# EAGLE design tiny-tinyisp (EAGLE 6.4)
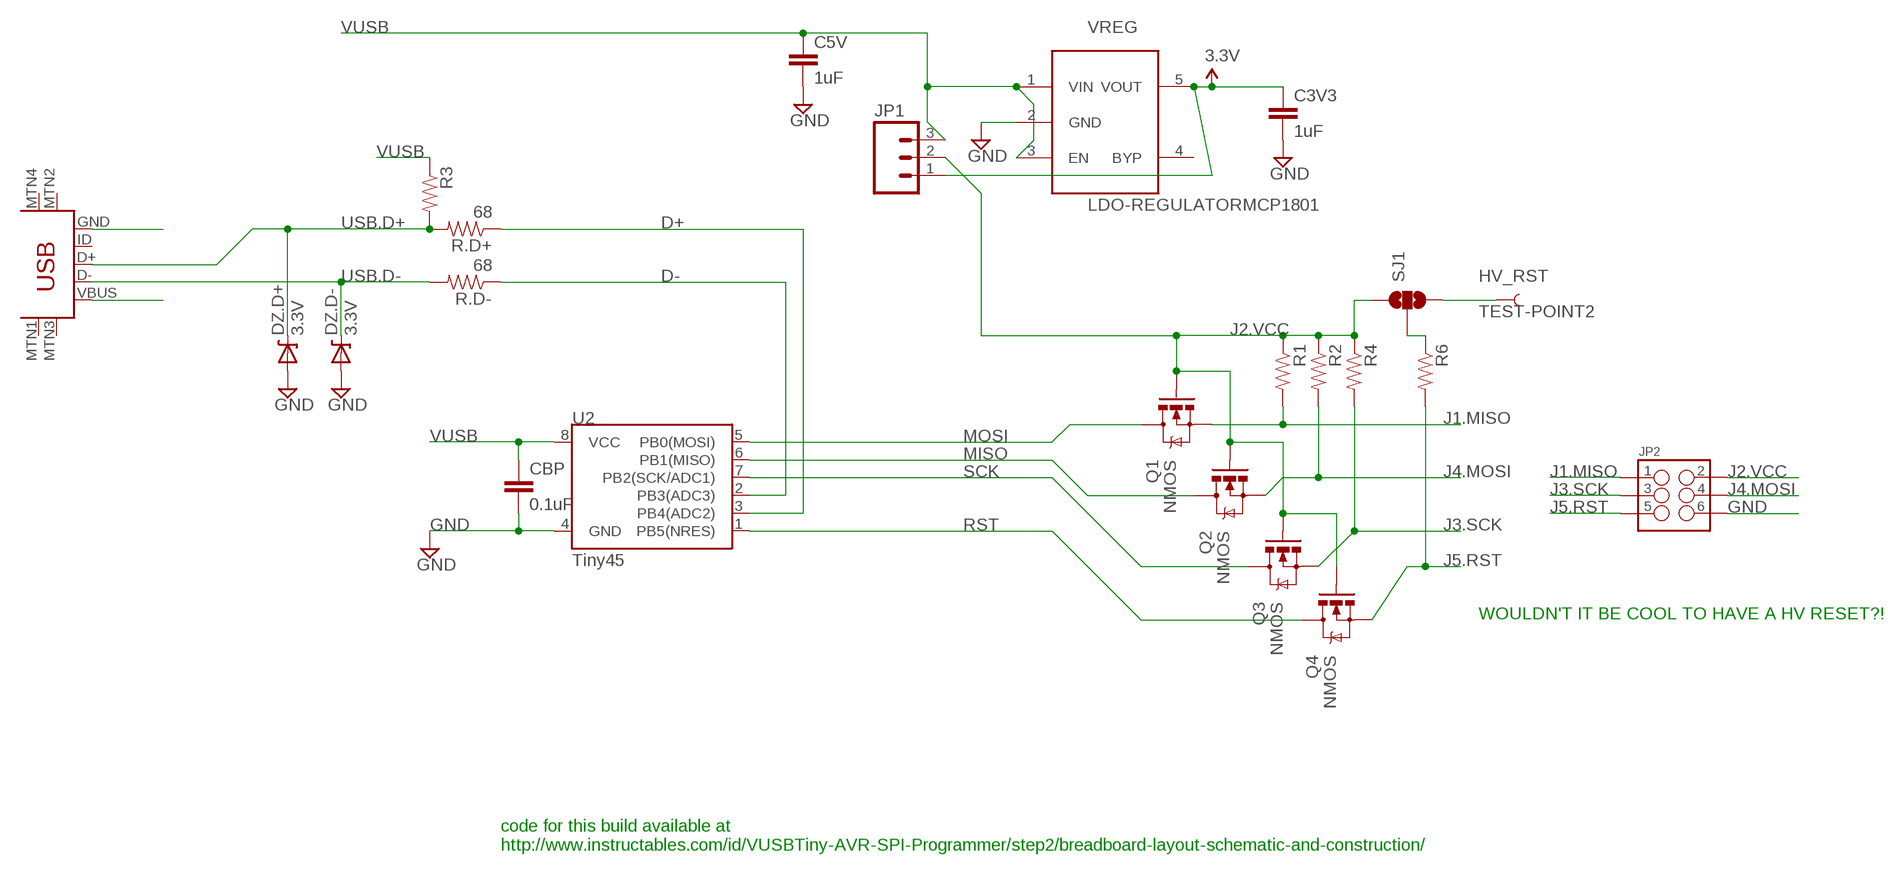
[diagram p0: schematic, sheet 1]

## Parts
C3V3  1uF  0.1UF-25V(+80/-20%)(0603)  [0603-CAP]
C5V  1uF  0.1UF-25V(+80/-20%)(0603)  [0603-CAP]
CBP  0.1uF  0.1UF-25V(+80/-20%)(0603)  [0603-CAP]
DZ.D+  3.3V  DIODE-ZENER-BZT52  [SOD-323]
DZ.D-  3.3V  DIODE-ZENER-BZT52  [SOD-323]
HV_RST  TEST-POINT2  [PAD.02X.02]
JP1  M03PTH  [1X03]
JP2  M03X22X3_SILK_SM  [2X3]
Q1  NMOS  MOSFET-NCHANNEL2N7002PW  [SOT323]
Q2  NMOS  MOSFET-NCHANNEL2N7002PW  [SOT323]
Q3  NMOS  MOSFET-NCHANNEL2N7002PW  [SOT323]
Q4  NMOS  MOSFET-NCHANNEL2N7002PW  [SOT323]
R1  RESISTOR0805-RES  [0805]
R2  RESISTOR0805-RES  [0805]
R3  RESISTOR0805-RES  [0805]
R4  RESISTOR0805-RES  [0805]
R6  RESISTOR0805-RES  [0805]
R.D+  68  RESISTOR0805-RES  [0805]
R.D-  68  RESISTOR0805-RES  [0805]
SJ1  SOLDERJUMPER_2WAYPASTE1&2  [SJ_3_PASTE1&2]
U2  Tiny45  ATTINY45TINY45-20-SMT  [SO08-EIAJ]
U$1  USB-MINIB  USB-MINIB-5PIN  [USB-MINIB]
VREG  LDO-REGULATORMCP1801  [SOT23-5L]

## Nets
3.3V: C3V3.1 JP1.1 VREG.5(VOUT)
D+: R.D+.1 U2.3(PB4(ADC2))
D-: R.D-.1 U2.2(PB3(ADC3))
GND: C3V3.2 C5V.2 CBP.2 DZ.D+.2(A) DZ.D-.2(A) JP2.6 U2.4(GND) U$1.GND VREG.2(GND)
HVRST: HV_RST.P$1 SJ1.3
J1.MISO: JP2.1 Q1.2(S) R1.2
J2.VCC: JP1.2 JP2.2 Q1.1(G) Q2.1(G) Q3.1(G) Q4.1(G) R1.1 R2.1 R4.1 SJ1.1
J3.SCK: JP2.3 Q3.2(S) R4.2
J4.MOSI: JP2.4 Q2.2(S) R2.2
J5.RST: JP2.5 Q4.2(S) R6.2
MISO: Q2.3(D) U2.6(PB1(MISO))
MOSI: Q1.3(D) U2.5(PB0(MOSI))
N$1: R6.1 SJ1.2
RST: Q4.3(D) U2.1(PB5(NRES))
SCK: Q3.3(D) U2.7(PB2(SCK/ADC1))
USB.D+: DZ.D+.1(C) R3.2 R.D+.2 U$1.D+
USB.D-: DZ.D-.1(C) R.D-.2 U$1.D-
VUSB: C5V.1 CBP.1 JP1.3 R3.1 U2.8(VCC) U$1.VBUS VREG.1(VIN) VREG.3(EN)
Unconnected: U$1.ID U$1.MTN1(MTN2) U$1.MTN2(MTN3) U$1.MTN3(MTN1) U$1.MTN4 VREG.4(BYP)

## Notes on the sheet
- WOULDN'T IT BE COOL TO HAVE A HV RESET?!
- code for this build available at
  http://www.instructables.com/id/VUSBTiny-AVR-SPI-Programmer/step2/breadboard-layout-schematic-and-construction/

## Library data of the parts
C3V3 C5V = SparkFun-Capacitors:0.1UF-25V(+80/-20%)(0603): Ceramic Standard decoupling cap CAP-00810; PROD_ID: CAP-00810; VALUE: 0.1uF
CBP = SparkFun-Capacitors:0.1UF-25V(+80/-20%)(0603): Ceramic Standard decoupling cap CAP-00810; PROD_ID: CAP-00810
DZ.D+ DZ.D- = SparkFun-DiscreteSemi:DIODE-ZENER: Zener Diode Production Part - 8199 3.4V Zener Voltage
HV_RST = SparkFun-Passives:TEST-POINT: Bare copper test points for troubleshooting or ICT
JP1 = SparkFun-Connectors:M03: Header 3 Standard 3-pin 0.1" header. Use with straight break away headers (SKU : PRT-00116), right angle break away headers (PRT-00553), swiss pins (PRT-00743), machine pins (PRT-00117), and female headers (PRT-00115). Molex polarized connector foot print use with SKU : PRT-08232 with associated crimp pins and housings.
JP2 = SparkFun-Connectors:M03X2: 2x3 .1" header. Shrouded, with keying- CONN-10681 SMT- CONN-11415 Pogo pins- HW-11044
Q1-Q4 = SparkFun-DiscreteSemi:MOSFET-NCHANNEL: Common NMOSFET Parts MFG P/N Store ID Prod ID FDD8780 TRANS-09984 SI7820DN TRANS-11055 FDS6630A IC-08089 2N7002PW TRANS-11151 FQP30N06L COM-10213 TRANS-10060 BSS123LT1G TRANS-08345 BSS138 TRANS-00830 BS170 2N7000; PROD_ID: TRANS-11151
R1-R4 R6 R.D+ R.D- = SparkFun-Passives:RESISTOR: Resistor Basic schematic elements and footprints for 0603, 1206, and PTH resistors.
SJ1 = SparkFun-Passives:SOLDERJUMPER_2WAY: Solder Jumper 2 way solder jumper
U2 = SparkFun-DigitalIC:ATTINY45: Atmel 8-pin 2/4/8kB flash uC; PROD_ID: IC-08922; VALUE: Tiny45-20-SMT
U$1 = SparkFun-Connectors:USB-MINIB: Mini-USB "B" connector with 5th pin broken out. Created new symbol breaking out 5th "ID" pin in mini/micro USB connector spec. See: http://en.wikipedia.org/wiki/Mini_usb#Cables. Uses same footprint as 4-pin symbol. Also added pins to connect to mounting / shield pads if required (probably not generally needed as signals aren't shielded once they leave the connector).
VREG = tekdemo:LDO-REGULATOR: Standard LDO Footprint

## Board
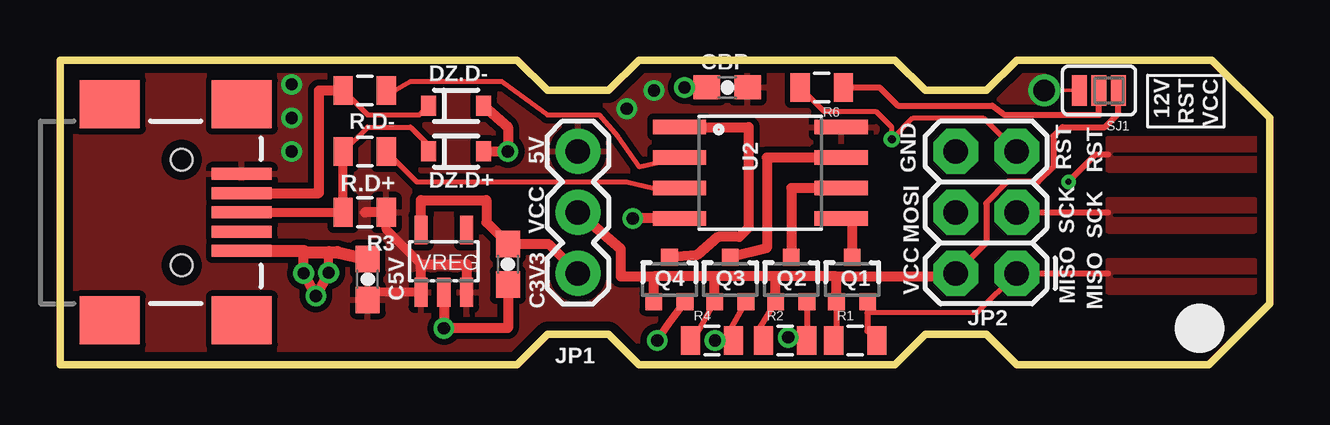
[diagram p1: board, top side]
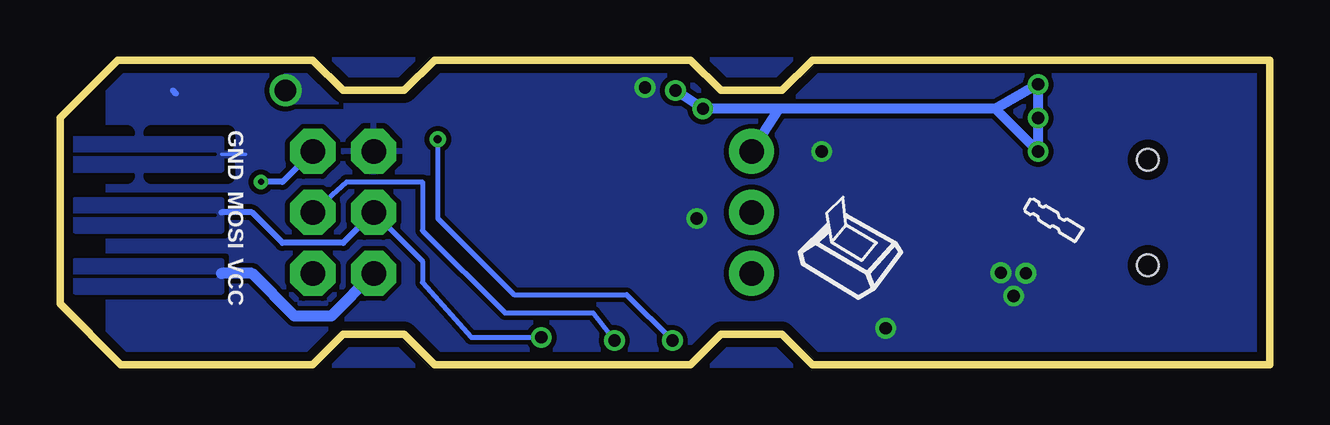
[diagram p2: board, bottom side, seen from below]

Size 50.42 x 12.7 mm. Coordinates in mm from the lower left corner, seen from the top.
Outline: 0,12.69 0,0 19.05,0 20.32,1.27 22.86,1.27 24.13,0 34.8,0 36.07,1.27 38.61,1.27 39.88,0 47.88,0 50.42,2.54 50.42,10.29 48.01,12.7 39.88,12.7 38.61,11.43 36.07,11.43 34.8,12.7 24.13,12.7 22.86,11.43 20.32,11.43 19.05,12.7 0,12.7
Copper layers (1*16): Top 0.0356mm / dielectric 1.5011mm / Bottom 0.0356mm
Design rules "LaenPCBOrder *": minimum track width 6mil, minimum drill 13mil, track to track 6mil, track to pad 6mil, pad to pad 6mil, via to via 6mil, smd to smd 6mil, copper to edge 15mil, drill to drill 6mil, minimum pad ring 7mil, minimum via ring 7mil, stop-mask expansion 4mil, vias tented up to drill 40mil, thermal gap 10mil
tRestrict: 3 lines
bRestrict: 10 lines

### Footprints (pad centres in the part's own frame; a part is rotated, then mirrored left to right if it is on the bottom)
0603-CAP = smd 1.1 x 1: 1 -0.85,0; 2 0.85,0
SOD-323 = smd 0.63 x 0.83: 1 -1.15,0; 2 1.15,0
PAD.02X.02 = smd 0.508 x 0.508: P$1 0,0
1X03 = drill 1.016 pad 1.88: 1 0,0; 2 2.54,0; 3 5.08,0
2X3 = drill 1.016 pad 1.88 octagon: 1 0,0; 2 0,2.54; 3 2.54,0; 4 2.54,2.54; 5 5.08,0; 6 5.08,2.54
SOT323 = smd 0.7 x 0.7: 1 -0.65,-0.925; 2 0.65,-0.925; 3 0,0.925
0805 = smd 0.8 x 1.2: 1 -0.9,0; 2 0.9,0
SJ_3_PASTE1&2 = smd 0.635 x 1.27: 1 -0.813,0; 2 0,0; 3 0.813,0
SO08-EIAJ = smd 0.61 x 2.21: 1 -1.905,-3.378; 2 -0.635,-3.378; 3 0.635,-3.378; 4 1.905,-3.378; 5 1.905,3.353; 6 0.635,3.353; 7 -0.635,3.353; 8 -1.905,3.353
USB-MINIB = smd 2.5 x 0.5: D+ 2.5,0; D- 2.5,0.8; GND 2.5,-1.6; ID 2.5,-0.8; VBUS 2.5,1.6 | smd 2.5 x 2: MTN1 -3,4.5; MTN2 2.5,4.5; MTN3 -3,-4.5; MTN4 2.5,-4.5 | hole 0.9: 0,2.2; 0,-2.2
SOT23-5L = smd 0.55 x 1.2: 1 -0.95,-1.3; 2 0,-1.3; 3 0.95,-1.3; 4 0.95,1.3; 5 -0.95,1.3

### Placement (x,y rotation side)
C3V3  18.67,4.19 270 top
C5V  12.83,3.56 90 top
CBP  27.81,11.56 180 top
DZ.D+  16.51,8.89 0 top
DZ.D-  16.51,10.8 0 top
HV_RST  41.02,11.43 0 top
JP1  21.59,3.81 90 top
JP2  39.88,3.81 90 top
Q1  33.02,3.56 0 top
Q2  30.48,3.56 0 top
Q3  27.94,3.56 0 top
Q4  25.4,3.56 0 top
R1  33.15,1.02 0 top
R2  30.23,1.02 0 top
R3  12.7,6.35 180 top
R4  27.18,1.02 0 top
R6  31.75,11.56 180 top
R.D+  12.7,8.89 180 top
R.D-  12.7,11.43 180 top
SJ1  43.31,11.43 180 top
U2  29.21,8 270 top
U$1  5.08,6.35 0 top
VREG  16,4.32 0 top

### Tracks (layer width: path | path; a pad name or v marks a point on that pad's centre or on a via)
3.3V
  Top 0.406: VREG.5 15.05,6.86 17.78,6.86 17.78,5.93 C3V3.1 20.36,5.04 JP1.1
D+
  Top 0.203: U2.3 24.77,7.37 23.62,7.62 14.87,7.62 R.D+.1
D-
  Top 0.203: U2.2 24.13,8.25 23.24,9.53 22.48,10.41 20.32,10.41 18.41,11.81 14.61,11.81 13.97,11.43 R.D-.1
GND  (via drill 0.51)
  Top 0.381: 11.2,3.89 11.2,4.7
  Top 0.406: v11.2,3.84 v10.67,2.87 v10.16,3.81 | v10.16,3.81 10.16,4.7 | 10.16,3.77 v10.16,3.81 | VREG.2 v16,1.52 18.67,1.52 C3V3.2 | DZ.D+.2 v18.67,8.89 18.68,9.9 DZ.D-.2 | U2.4 v23.88,6.1 | CBP.2 v26.04,11.56
  Top 0.508: U$1.GND 10.16,4.75 10.16,4.7 11.2,4.7 11.56,4.7 C5V.2
  Bottom 0.152: 42.67,8.76 43.69,8.76
  Bottom 0.254: 45.72,11.43 45.59,11.3
  pour Bottom (isolate 0.203, rank 2): 0,0 0,12.7 48.01,12.7 48.41,11.81 48.41,0.64 47.9,0
  pour Bottom: 43.69,8.13 43.69,9.4 49.91,9.4 49.91,8.13
HVRST  (via drill 0.89)
  Top 0.152: SJ1.3 HV_RST.P$1
  other vias: 41.02,11.43
  pour Top: 41.02,10.92 38.73,10.92 38.73,12.7 41.02,12.7
  pour Bottom: 41.02,10.92 38.73,10.92 38.73,12.7 41.02,12.7
J1.MISO
  Top 0.203: Q1.2 33.66,2.16 38.23,2.16 JP2.1
  Top 0.254: JP2.1 43.69,3.81 | 33.66,2.16 33.66,1.41 R1.2
  pour Top: 43.69,4.32 43.69,3.05 49.78,3.05 49.78,4.32
J2.VCC
  Top 0.254: Q3.1 26.53,1.27 arc-90 R4.1 | Q2.1 29.07,1.4 R2.1 | Q1.1 32.37,1.14 R1.1 | JP2.2 38.61,5.08 38.61,6.73 39.5,7.62 40.77,7.62 41.4,8.25 41.4,9.53 41.78,9.91 43.56,9.91 44.12,10.46 SJ1.1
  Top 0.406: 32.37,3.68 29.83,3.68 | 29.83,3.68 27.29,3.68 | 27.29,3.68 24.75,3.68 | JP1.2 23.37,4.83 23.37,3.68 24.75,3.68 | Q4.1 24.75,3.68 | Q3.1 27.29,3.68 | Q2.1 29.83,3.68 | Q1.1 32.37,3.68 | 32.37,3.68 36.32,3.68 JP2.2
  Bottom 0.457: JP2.2 39.12,2.03 40.64,2.03 42.42,3.81 43.69,3.81
  pour Bottom: 43.69,3.05 43.69,4.32 49.78,4.32 49.78,3.05
J3.SCK  (via drill 0.51)
  Top 0.254: JP2.3 43.69,6.35 | v27.3,1.02 R4.2 27.83,1.27 Q3.2
  Bottom 0.203: v27.3,1.02 28.19,2.16 31.88,2.16 35.31,5.59 35.31,7.62 38.48,7.62 JP2.3
  pour Top: 43.69,6.86 43.69,5.59 49.78,5.59 49.78,6.86
J4.MOSI  (via drill 0.51)
  Top 0.254: v30.35,1.14 30.48,1.02 R2.2 Q2.2
  Bottom 0.203: JP2.4 35.31,4.32 35.31,3.43 33.27,1.14 v30.35,1.14
  Bottom 0.254: JP2.4 38.61,5.08 41.15,5.08 42.42,6.35 43.69,6.35
  pour Bottom: 43.69,5.59 43.69,6.86 49.78,6.86 49.78,5.59
J5.RST  (via drill 0.25, 0.33, 0.51)
  Top 0.203: R6.2 31.87,10.54 34.04,10.54 34.67,9.91 v34.67,9.4 35.56,10.29 38.48,10.29 JP2.5
  Top 0.254: v42.04,7.62 43.18,8.76 43.69,8.76
  Top 0.305: Q4.2 25.41,1.78 v24.89,1.02
  Bottom 0.203: v34.67,9.4 34.67,6.1 31.5,2.92 26.8,2.92 v24.89,1.02
  Bottom 0.254: JP2.5 41.15,7.62 v42.04,7.62
  pour Top: 43.69,9.4 43.69,8.13 49.91,8.13 49.91,9.4
MISO
  Top 0.406: U2.6 30.48,7.37 Q2.3
MOSI
  Top 0.406: U2.5 33.02,6.1 Q1.3
N$1
  Top 0.254: R6.1 34.16,11.56 34.92,10.8 38.86,10.8 39.37,10.41 43.31,10.41 SJ1.2
RST
  Top 0.406: U2.1 28.7,9.91 28.7,5.71 28.32,5.33 27.43,5.33 26.54,4.57 Q4.3
SCK
  Top 0.406: U2.7 29.46,8.64 29.46,4.86 Q3.3
USB.D+
  Top 0.203: R.D+.2 12.82,9.91 14.61,9.91 15.36,9.15
  Top 0.254: 15.36,9.15 DZ.D+.1
  Top 0.381: U$1.D+ R3.2 R.D+.2
USB.D-
  Top 0.203: R.D-.2 12.82,10.41 14.98,10.41 DZ.D-.1
  Top 0.406: U$1.D- 10.79,7.15 10.79,11.43 R.D-.2
VUSB  (via drill 0.51)
  Top 0.381: VREG.1 12.83,3.02 C5V.1 | 15.05,4.19 13.6,5.64 R3.1
  Top 0.406: R3.1 12.7,6.35 | VREG.1 15.05,4.19 16.95,4.19 VREG.3
  Bottom 0.406: 11.43,10.67 v9.65,8.89 v9.65,10.29 v9.65,11.68 11.43,10.67 | 11.43,10.67 20.45,10.67 | 20.45,10.67 JP1.3 | 20.45,10.67 v23.62,10.67 v24.77,11.43
  pour Top (isolate 0.254, rank 2): 0.13,0 0,12.7 49.28,12.7 48.13,11.18 48.13,0

### Text on the board
tPlace: 12V | RST | VCC | RST | 5V | GND | RST | SCK | VCC | MOSI | SCK | MISO | VCC | MISO
bPlace: GND | MOSI | VCC
bStop: 1 | 2 | 5 | 4 | 4 | 4 | tiny-tiny-isp | F | 4 | 3 | 4 | v2 05JAN2013 | tekdemo@gmail.com